# Altium project Kasli-SOC.PrjPcb (part 8 of 11)

## Sheet Kasli-SOC_PWR.SchDoc: Power
size 420 x 297 mm; CheckedBy: G.Kasprowicz; Author: F.Switakowski; CompanyName: WUT ISE; DrawnBy: F.Switakowski; Organization: WUT ISE; Address1: PW ISE; Address2: Nowowiejska 15/19 00-665 Warsaw; Address3: gkasprow@gmail.com; DocumentNumber: 15; Revision: 1; SheetNumber: 15; SheetTotal: 18; ModifiedBy: -; CheckedDate: -; Title2: Entry; DivGrp: WUT ISE; Designer: G.Kasprowicz; ModifiedDate: -; ProjectName: Sensor Box
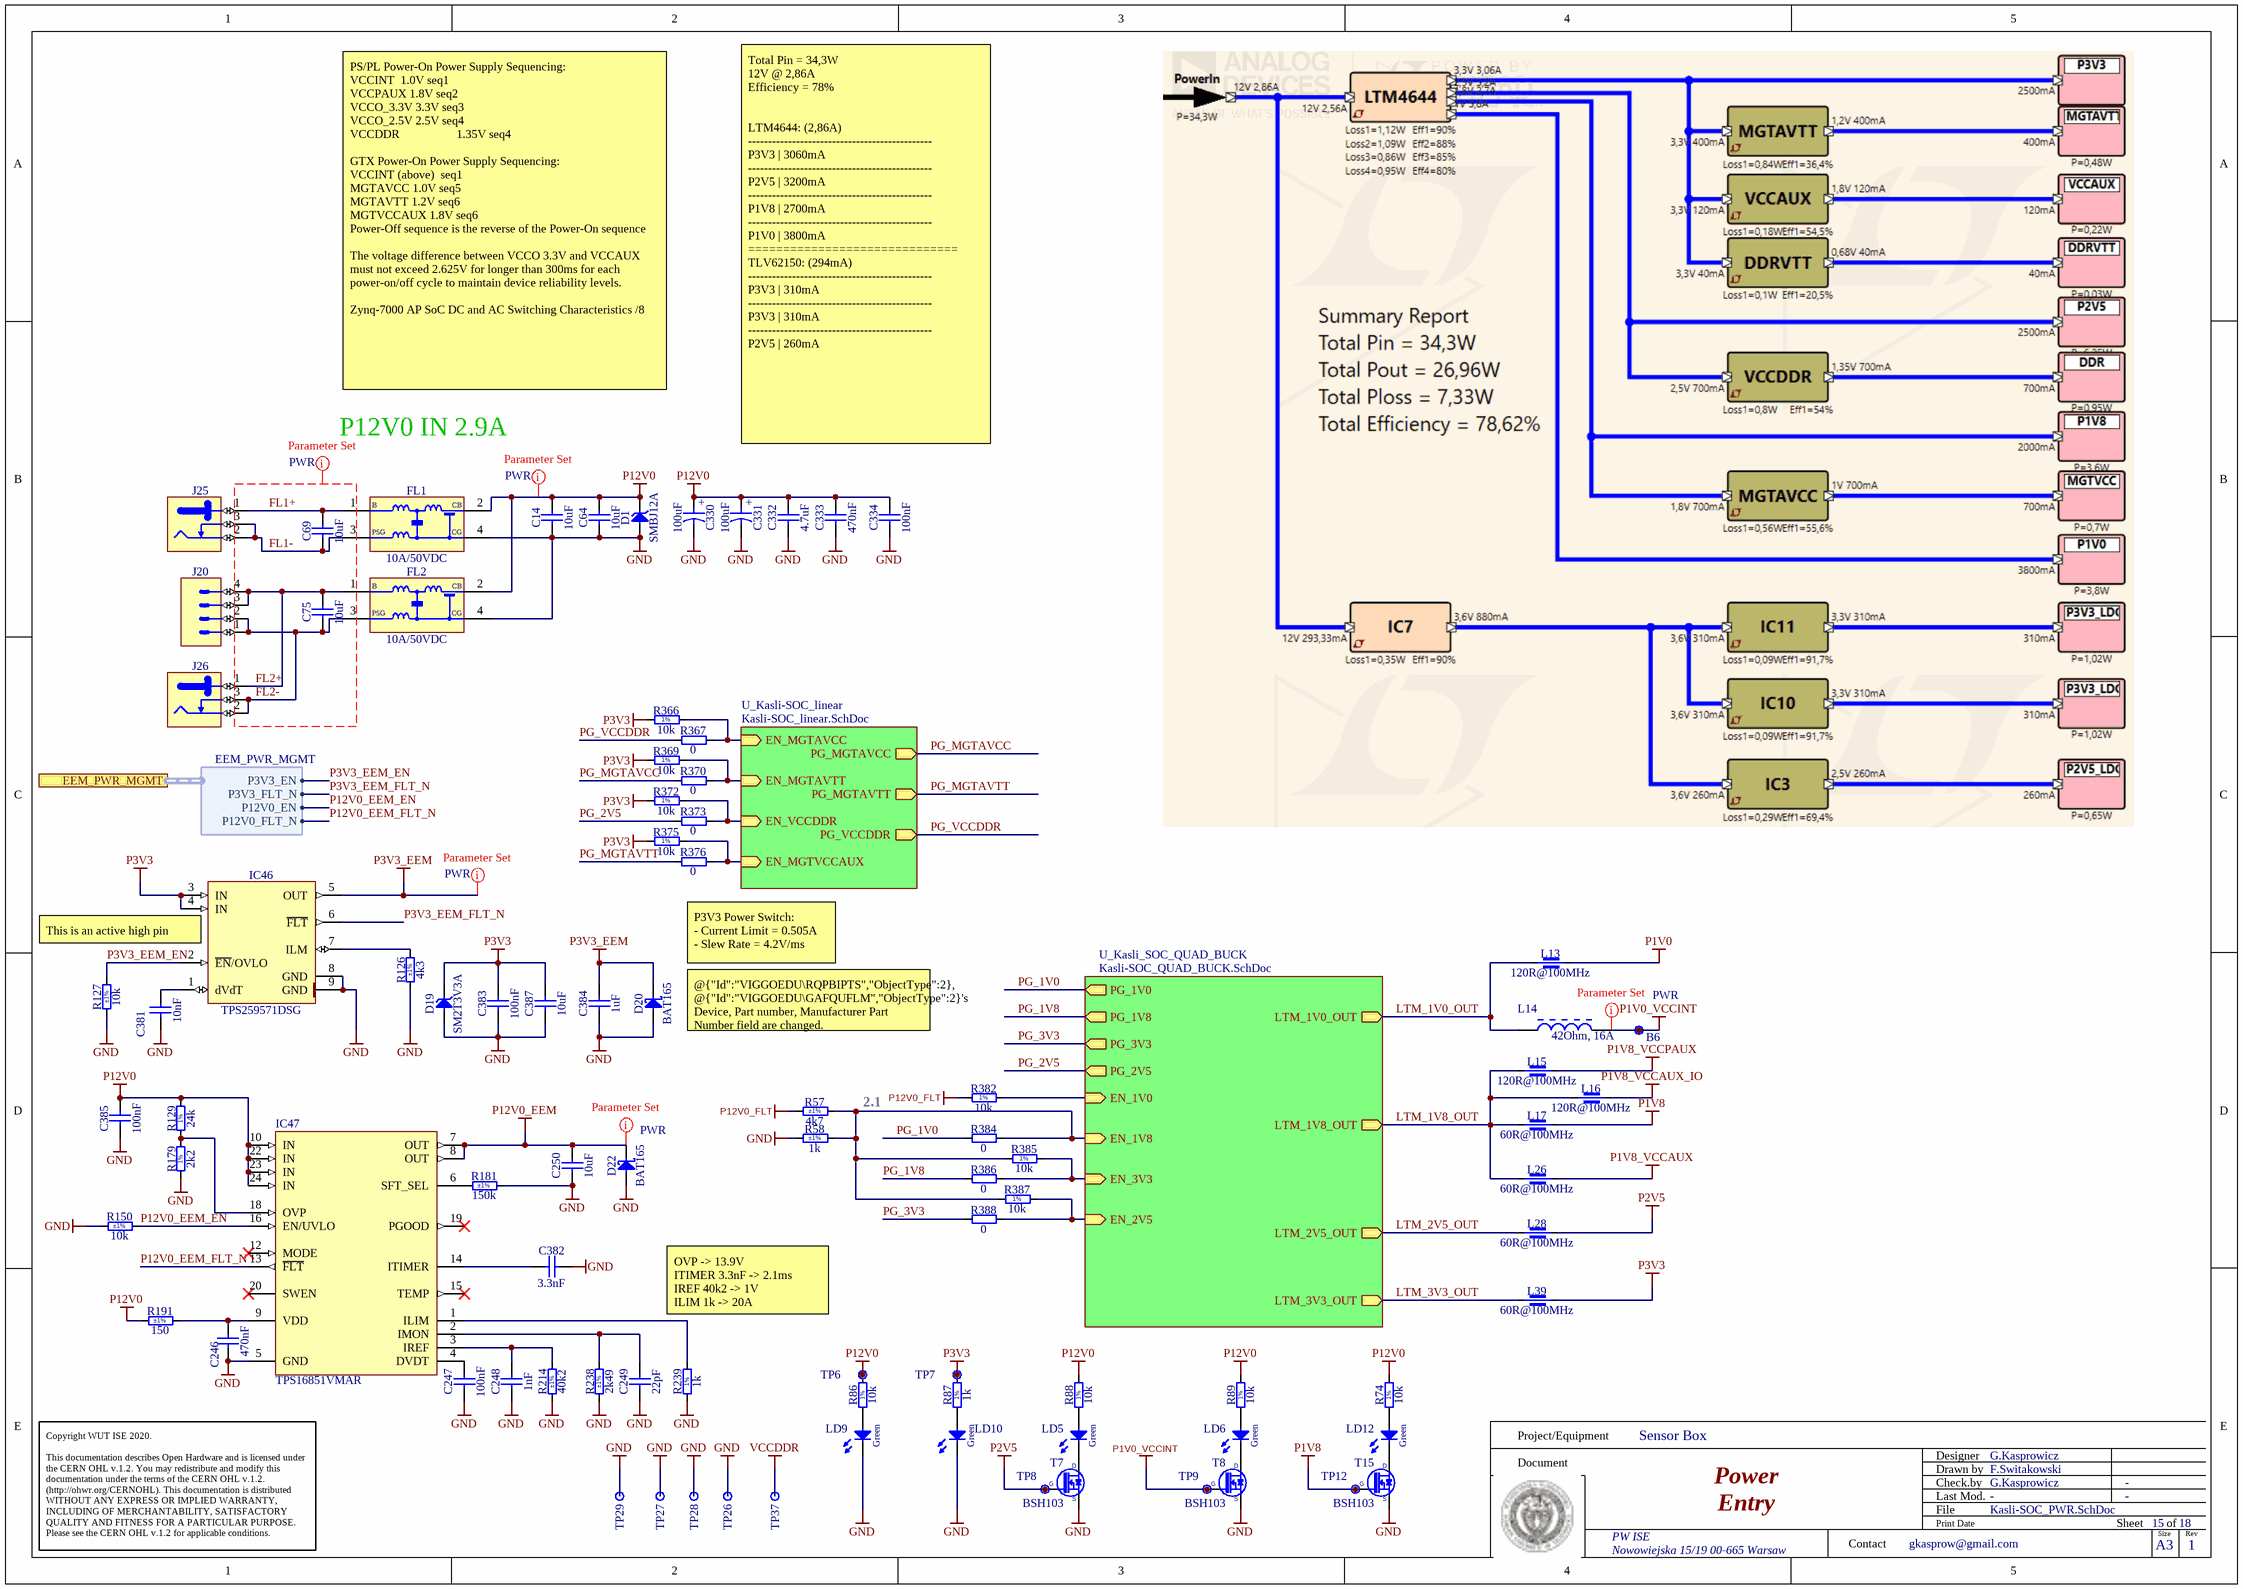
[diagram p13: Kasli-SOC_PWR.SchDoc]

### Parts
B6  SMD Pad  [C75]  (value not drawn)  (no BOM)
C14  10uF  [CAPC2012X95N]
C64  10uF  [CAPC2012X95N]
C69  10uF  [CAPC2012X95N]
C75  10uF  [CAPC2012X95N]
C246  470nF  [CAPC1005X55N]
C247  100nF  [CAPC1608X87N]
C248  1nF  [CAPC1005X55N]
C249  22pF  [CAPC1005X55N]
C250  10uF  [CAPC2012X95N]
C330  100uF  [CAPMP7343X310N]
C331  100uF  [CAPMP7343X310N]
C332  4.7uF  [CAPC1709X95N]
C333  470nF  [CAPC1005X55N]
C334  100nF  [CAPC1005X55N]
C381  10nF  [CAPC1005X55N]
C382  3.3nF  [CAPC1005X55N]
C383  100nF  [CAPC1608X87N]
C384  1uF  [CAPC1608X87N]
C385  100nF  [CAPC1608X87N]
C387  10uF  [CAPC2012X95N]
D1  SMBJ12A  [DIOM5336X265N]
D19  SM2T3V3A  [DO-216AA]
D20  BAT165  [SOD2512X110N]
D22  BAT165  [SOD2512X110N]
FL1  10A/50VDC  [FIL_MURATA_BNX02]
FL2  10A/50VDC  [FIL_MURATA_BNX02]
IC46  TPS259571DSG  [SON50P200X200X80-9N-R100X170]
IC47  TPS16851VMAR  [TPS16850VMAR]
J20  Mini-Fit Jr.™  [MOLEX_39-30-0040]  (value not drawn)
J25  Jack  [SWITCHCRAFT_712RA]  (value not drawn)
J26  Jack  [SWITCHCRAFT_712RA]  (value not drawn)
L13  120R@100MHz  [INDC1608X95N]
L14  42Ohm, 16A  [WE-PBF_4030_74279390]
L15  120R@100MHz  [INDC1608X95N]
L16  120R@100MHz  [INDC1608X95N]
L17  60R@100MHz  [INDC4516X180N]
L26  60R@100MHz  [INDC4516X180N]
L28  60R@100MHz  [INDC4516X180N]
L39  60R@100MHz  [INDC4516X180N]
LD5  Green  [LED_KINGBRIGHT_KPH-1608CGCK]
LD6  Green  [LED_KINGBRIGHT_KPH-1608CGCK]
LD9  Green  [LED_KINGBRIGHT_KPH-1608CGCK]
LD10  Green  [LED_KINGBRIGHT_KPH-1608CGCK]
LD12  Green  [LED_KINGBRIGHT_KPH-1608CGCK]
R57  4k7  Tolerance: ±1%  [RESC1005X40N]
R58  1k  Tolerance: ±1%  [RESC1005X40N]
R74  10k  [RESC1005X40N]
R86  10k  [RESC1005X40N]
R87  1k  [RESC1005X40N]
R88  10k  [RESC1005X40N]
R89  10k  [RESC1005X40N]
R126  4k3  Tolerance: ±1%  [RESC1005X40N]
R127  10k  Tolerance: ±1%  [RESC1005X40N]
R129  24k  [RESC1005X40N]
R150  10k  Tolerance: ±1%  [RESC1005X40N]
R179  2k2  [RESC1005X40N]
R181  150k  Tolerance: ±1%  [RESC1005X40N]
R191  150  Tolerance: ±1%  [RESC1005X40N]
R214  40k2  Tolerance: ±1%  [RESC1005X40N]
R238  2k49  Tolerance: ±1%  [RESC1608X55N]
R239  1k  [RESC1005X40N]
R366  10k  [RESC1005X40N]
R367  0  [RESC1005X40N]
R369  10k  [RESC1005X40N]
R370  0  [RESC1005X40N]
R372  10k  [RESC1005X40N]
R373  0  [RESC1005X40N]
R375  10k  [RESC1005X40N]
R376  0  [RESC1005X40N]
R382  10k  [RESC1005X40N]
R384  0  [RESC1005X40N]
R385  10k  [RESC1005X40N]
R386  0  [RESC1005X40N]
R387  10k  [RESC1005X40N]
R388  0  [RESC1005X40N]
T7  BSH103  [SOT95P230X110-3N]
T8  BSH103  [SOT95P230X110-3N]
T15  BSH103  [SOT95P230X110-3N]
TP6  P12V0  [TPS127]  (value not drawn)  (no BOM)
TP7  P3V3  [TPS127]  (value not drawn)  (no BOM)
TP8  P2V5  [TPS127]  (value not drawn)  (no BOM)
TP9  P1V0  [TPS127]  (value not drawn)  (no BOM)
TP12  P1V8  [TPS127]  (value not drawn)  (no BOM)
TP26  Test Point  [TPS127]  (value not drawn)  (no BOM)
TP27  Test Point  [TPS127]  (value not drawn)  (no BOM)
TP28  Test Point  [TPS127]  (value not drawn)  (no BOM)
TP29  Test Point  [VERO_20-313145]  (value not drawn)  (no BOM)
TP37  Test Point  [TPS127]  (value not drawn)  (no BOM)

### Sub-sheets
U_Kasli-SOC_linear = Kasli-SOC_linear.SchDoc: EN_MGTAVCC (in), EN_MGTAVTT (in), EN_VCCDDR (in), PG_MGTAVCC (out), PG_MGTAVTT (out), PG_VCCDDR (out), EN_MGTVCCAUX (in)
U_Kasli_SOC_QUAD_BUCK = Kasli-SOC_QUAD_BUCK.SchDoc: LTM_1V8_OUT (out), LTM_2V5_OUT (out), LTM_3V3_OUT (out), EN_1V0 (in), EN_1V8 (in), EN_2V5 (in), EN_3V3 (in), LTM_1V0_OUT (out), PG_1V0 (out), PG_1V8 (out), PG_3V3 (out), PG_2V5 (out)

### Ports
EEM_PWR_MGMT (harness EEM_PWR_MGMT)

### Harnesses
EEM_PWR_MGMT: P3V3_EN, P12V0_EN, P3V3_FLT_N, P12V0_FLT_N

### Nets
GND: C14.1 C64.1 C246.1 C247.1 C248.1 C249.1 C250.1 C330.2 C331.2 C332.1 C333.1 C334.1 C381.1 C382.2 C383.1 C384.1 C385.1 C387.1 D1.2(A) D19.2(A) D20.2(A) D22.2(A) FL1.4(CG) FL2.4(CG) IC46.8(GND) IC46.9(GND) IC47.5(GND) LD9.1(C) LD10.1(C) R58.1 R126.1 R127.1 R150.1 R179.1 R181.2 R214.1 R238.1 R239.1 T7.2(S) T8.2(S) T15.2(S) TP26.1 TP27.1 TP28.1 TP29.1
P1V0: L13.1
P1V0_VCCINT: B6.1 L14.2 T8.1(G) TP9.1
P1V8: L17.2 T15.1(G) TP12.1
P1V8_VCCAUX: L26.2
P1V8_VCCAUX_IO: L16.1
P1V8_VCCPAUX: L15.1
P2V5: L28.2 T7.1(G) TP8.1
P3V3: C383.2 C387.2 D19.1(C) IC46.3(IN) IC46.4(IN) L39.2 R87.2 R366.1 R369.1 R372.1 R375.1 TP7.1
P3V3_EEM: C384.2 D20.1(C) IC46.5(OUT)
P12V0: C14.2 C64.2 C330.1 C331.1 C332.2 C333.2 C334.2 C385.2 D1.1(C) FL1.2(CB) FL2.2(CB) IC47.10(IN) IC47.22(IN) IC47.23(IN) IC47.24(IN) R74.2 R86.2 R88.2 R89.2 R129.2 R191.1 TP6.1
P12V0_EEM: C250.2 D22.1(C) IC47.7(OUT) IC47.8(OUT)
P12V0_FLT: R57.1 R382.1
VCCDDR: TP37.1
EN_1V0: R382.2 ; sheet U_Kasli_SOC_QUAD_BUCK/EN_1V0
EN_1V8: R57.2 R58.2 R384.2 R385.1 R387.1 ; sheet U_Kasli_SOC_QUAD_BUCK/EN_1V8
EN_2V5: R387.2 R388.2 ; sheet U_Kasli_SOC_QUAD_BUCK/EN_2V5
EN_3V3: R385.2 R386.2 ; sheet U_Kasli_SOC_QUAD_BUCK/EN_3V3
EN_MGTAVCC: R366.2 R367.2 ; sheet U_Kasli-SOC_linear/EN_MGTAVCC
EN_MGTAVTT: R369.2 R370.2 ; sheet U_Kasli-SOC_linear/EN_MGTAVTT
EN_MGTVCCAUX: R375.2 R376.2 ; sheet U_Kasli-SOC_linear/EN_MGTVCCAUX
EN_VCCDDR: R372.2 R373.2 ; sheet U_Kasli-SOC_linear/EN_VCCDDR
FL1+: C69.2 FL1.1(B) J25.1
FL1-: C69.1 FL1.3(PSG) J25.2 J25.3
FL2+: C75.2 FL2.1(B) J20.3 J20.4 J26.1
FL2-: C75.1 FL2.3(PSG) J20.1 J20.2 J26.2 J26.3
LTM_1V0_OUT: L13.2 L14.1 ; sheet U_Kasli_SOC_QUAD_BUCK/LTM_1V0_OUT
LTM_1V8_OUT: L15.2 L16.2 L17.1 L26.1 ; sheet U_Kasli_SOC_QUAD_BUCK/LTM_1V8_OUT
LTM_2V5_OUT: L28.1 ; sheet U_Kasli_SOC_QUAD_BUCK/LTM_2V5_OUT
LTM_3V3_OUT: L39.1 ; sheet U_Kasli_SOC_QUAD_BUCK/LTM_3V3_OUT
P12V0_EEM_EN: IC46.2(~{EN}/OVLO) IC47.16(EN/UVLO) R127.2 R150.2 ; port EEM_PWR_MGMT.P3V3_EN, port EEM_PWR_MGMT.P12V0_EN  [also labelled P3V3_EEM_EN]  [project net EEM_PWR_EN]
P12V0_EEM_FLT_N: IC46.6(~{FLT}) IC47.13(~{FLT}) ; port EEM_PWR_MGMT.P3V3_FLT_N, port EEM_PWR_MGMT.P12V0_FLT_N  [also labelled P3V3_EEM_FLT_N]  [project net EEM_FLT_N]
PG_1V0: R384.1 ; sheet U_Kasli_SOC_QUAD_BUCK/PG_1V0
PG_1V8: R386.1 ; sheet U_Kasli_SOC_QUAD_BUCK/PG_1V8
PG_2V5: R373.1 ; sheet U_Kasli_SOC_QUAD_BUCK/PG_2V5
PG_3V3: R388.1 ; sheet U_Kasli_SOC_QUAD_BUCK/PG_3V3
PG_MGTAVCC: R370.1 ; sheet U_Kasli-SOC_linear/PG_MGTAVCC
PG_MGTAVTT: R376.1 ; sheet U_Kasli-SOC_linear/PG_MGTAVTT
PG_VCCDDR: R367.1 ; sheet U_Kasli-SOC_linear/PG_VCCDDR
NetC246_2: C246.2 IC47.9(VDD) R191.2
NetC247_2: C247.2 IC47.4(DVDT)
NetC248_2: C248.2 IC47.3(IREF) R214.2
NetC249_2: C249.2 IC47.2(IMON) R238.2
NetC381_2: C381.2 IC46.1(dVdT)
NetC382_1: C382.1 IC47.14(ITIMER)
NetIC46_7: IC46.7(ILM) R126.2
NetIC47_1: IC47.1(ILIM) R239.2
NetIC47_6: IC47.6(SFT_SEL) R181.1
NetIC47_18: IC47.18(OVP) R129.1 R179.2
NetLD5_1: LD5.1(C) T7.3(D)
NetLD5_2: LD5.2(A) R88.1
NetLD6_1: LD6.1(C) T8.3(D)
NetLD6_2: LD6.2(A) R89.1
NetLD9_2: LD9.2(A) R86.1
NetLD10_2: LD10.2(A) R87.1
NetLD12_1: LD12.1(C) T15.3(D)
NetLD12_2: LD12.2(A) R74.1

Not connected (* = marked no-connect by the designer): IC47 12(MODE)* 15(TEMP)* 19(PGOOD)* 20(SWEN)*

### Layout directives
net class PWR: FL1+, FL1-, FL2+, FL2-, P1V0_VCCINT, P3V3_EEM, P12V0, P12V0_EEM

### Notes on the sheet
- PS/PL Power-On Power Supply Sequencing:
  VCCINT		1.0V	seq1
  VCCPAUX	1.8V	seq2
  VCCO_3.3V	3.3V	seq3
  VCCO_2.5V	2.5V	seq4
  VCCDDR                  	1.35V	seq4
  GTX Power-On Power Supply Sequencing:
  VCCINT (above)		seq1
  MGTAVCC	1.0V	seq5
  MGTAVTT	1.2V	seq6
  MGTVCCAUX	1.8V	seq6
  Power-Off sequence is the reverse of the Power-On sequence
  The voltage difference between VCCO 3.3V and VCCAUX
  must not exceed 2.625V for longer than 300ms for each
  power-on/off cycle to maintain device reliability levels.
  Zynq-7000 AP SoC DC and AC Switching Characteristics /8
- P12V0 IN 2.9A
- Total Pin = 34,3W
  12V @ 2,86A
  Efficiency = 78%
  LTM4644: (2,86A)
  ----------------------------------------------
  P3V3	| 3060mA
  ----------------------------------------------
  P2V5	| 3200mA
  ----------------------------------------------
  P1V8	| 2700mA
  ----------------------------------------------
  P1V0	| 3800mA
  ==============================
  TLV62150: (294mA)
  ----------------------------------------------
  P3V3	| 310mA
  ----------------------------------------------
  P3V3	| 310mA
  ----------------------------------------------
  P2V5	| 260mA
- (near IC46) This is an active high pin
- P3V3 Power Switch:
  - Current Limit = 0.505A
  - Slew Rate = 4.2V/ms
- (near D20) @{"Id":"VIGGOEDU\RQPBIPTS","ObjectType":2}, @{"Id":"VIGGOEDU\GAFQUFLM","ObjectType":2}'s Device, Part number, Manufacturer Part Number field are changed.
  This symbol needs updating.
- 2.1
- VCCPAUX i VCCAUX
- OVP -> 13.9V
  ITIMER 3.3nF -> 2.1ms
  IREF 40k2 -> 1V
  ILIM 1k -> 20A
- Project/Equipment
- Document
- Designer
- Drawn by
- Check.by
- Copyright WUT ISE 2020.
  This documentation describes Open Hardware and is licensed under the CERN OHL v.1.2. You may redistribute and modify this documentation under the terms of the CERN OHL v.1.2. (http://ohwr.org/CERNOHL). This documentation is distributed WITHOUT ANY EXPRESS OR IMPLIED WARRANTY, INCLUDING OF MERCHANTABILITY, SATISFACTORY QUALITY AND FITNESS FOR A PARTICULAR PURPOSE. Please see the CERN OHL v.1.2 for applicable conditions.
- Contact
- File
- Last Mod.
- Print Date
- Sheet
- Size
- A3
- of
- Rev
- (in symbol CTE7343-31_100UF_20V_10%) +
- (in symbol R0402_1k_1%_0.0625W_100PPM) 1%
- (in symbol R0402_2K2_1%_0.0625W_100PPM) 1%
- (in symbol R0402_10k_1%_0.0625W_100PPM) 1%
- (in symbol R0402_10K_1%_0.0625W_100PPM) 1%
- (in symbol R0402_24K_1%_0.0625W_100PPM) 1%

### Library data of the parts
B6 = SMD_PAD_D0.75MM: Through Hole Pad; Part Description: 0.75mm Diameter SMD Pad; Mounted: No; Part Number: SMD_PAD_D0.75MM; Component Type: Standard (No BOM); Pin Count: 1; Family: SMD Pad; Socket: No; SMD: No; Sense: No; Status: None; ComponentHeight: 0mm; HelpURL: Undefined; Author: CERN DEM BC; CreateDate: 04.06.2020; LatestRevisionDate: 04.06.2020; PackageDescription: 0.75mm Diameter SMD Pad
C14 C64 C69 C75 C250 C387 = CC0805_10UF_25V_10%_X5R: Non-polarised capacitor; Part Description: SMD Multilayer Chip Ceramic Capacitor; Manufacturer: GENERIC; Manufacturer1 Part Number: GRM219R61E106KA12D; Voltage: 25V; TC: X5R; Tolerance: ±10%; Part Number: CC0805_10UF_25V_10%_X5R; Component Kind: Standard; Component Type: Standard; Pin Count: 2; Value: 10uF; Status: Preferred; Manufacturer Part Number: CC0805_10UF_25V_10%_X5R; Case: 0805; Mounted: Yes; Socket: No; SMD: Yes; Sense: No; Manufacturer1 Example: MURATA; Manufacturer1 ComponentHeight: 0.95mm; HelpURL: \\cern.ch\dfs\Applications\Altium\Datasheets\CC0805_X5R_MURATA_GRM.pdf; Author: CERN DEM JLC; CreateDate: 25.10.2012; LatestRevisionDate: 06.09.2016
C246 C333 = CC0402_470NF_16V_10%_X5R: Non-polarised capacitor; Part Description: SMD Multilayer Chip Ceramic Capacitor; Manufacturer: GENERIC; Manufacturer1 Part Number: C1005X5R1C105KT; Voltage: 16V; TC: X5R; Tolerance: ±10%; Part Number: CC0402_470NF_16V_10%_X5R; Component Kind: Standard; Component Type: Standard; Pin Count: 2; Value: 470nF; Status: Preferred; Manufacturer Part Number: CC0402_470NF_16V_10%_X5R; Case: 0402; Mounted: Yes; Socket: No; SMD: Yes; Sense: No; Manufacturer1 Example: TDK; Manufacturer1 ComponentHeight: 0.55mm; HelpURL: \\cern.ch\dfs\Applications\Altium\Datasheets\CC0402_X5R_TDK_C.pdf; Author: CERN DEM JLC; CreateDate: 10/25/2012; LatestRevisionDate: 10/25/2012
C247 C383 C385 = CC0603_100NF_50V_10%_X7R: Non-polarised capacitor; Part Description: SMD Multilayer Chip Ceramic Capacitor; Manufacturer: GENERIC; Manufacturer1 Part Number: 223858615649; Voltage: 50V; TC: X7R; Tolerance: ±10%; Part Number: CC0603_100NF_50V_10%_X7R; Component Kind: Standard; Component Type: Standard; Pin Count: 2; Value: 100nF; Status: Preferred; Manufacturer Part Number: CC0603_100NF_50V_10%_X7R; Case: 0603; Mounted: Yes; Socket: No; SMD: Yes; Sense: No; Manufacturer1 Example: PHYCOMP; Manufacturer1 ComponentHeight: 0.87mm; HelpURL: \\cern.ch\dfs\Applications\Altium\Datasheets\CC0603_X7R_PHYCOMP.pdf; Author: CERN DEM JLC; CreateDate: 12/3/2007; LatestRevisionDate: 12/3/2007
C248 = CC0402_1NF_50V_10%_X7R: Non-polarised capacitor; Part Description: SMD Multilayer Chip Ceramic Capacitor; Manufacturer: GENERIC; Manufacturer1 Part Number: 223858715623; Voltage: 50V; TC: X7R; Tolerance: ±10%; Part Number: CC0402_1NF_50V_10%_X7R; Component Kind: Standard; Component Type: Standard; Pin Count: 2; Value: 1nF; Status: Not Recommended; Manufacturer Part Number: CC0402_1NF_50V_10%_X7R; Case: 0402; Mounted: Yes; Socket: No; SMD: Yes; Sense: No; Manufacturer1 Example: PHYCOMP; Manufacturer1 ComponentHeight: 0.55mm; HelpURL: \\cern.ch\dfs\Applications\Altium\Datasheets\CC0402_X7R_PHYCOMP.pdf; Author: CERN DEM JLC; CreateDate: 03/12/2007; LatestRevisionDate: 03/12/2007
C249 = CC0402_22PF_50V_5%_C0G: Non-polarised capacitor; Part Description: SMD Multilayer Chip Ceramic Capacitor; Manufacturer: GENERIC; Manufacturer1 Part Number: C0402C220J5GACTU; Voltage: 50V; TC: C0G/NP0; Tolerance: ±5%; Part Number: CC0402_22PF_50V_5%_C0G; Component Kind: Standard; Component Type: Standard; Pin Count: 2; Value: 22pF; Status: Preferred; Manufacturer Part Number: CC0402_22PF_50V_5%_C0G; Case: 0402; Mounted: Yes; Socket: No; SMD: Yes; Sense: No; Manufacturer1 Example: KEMET; Manufacturer1 ComponentHeight: 0.55mm; HelpURL: \\cern.ch\dfs\Applications\Altium\Datasheets\CC0805_C0G_KEMET_(Commercial Grade).pdf; Author: CERN DEM JLC; CreateDate: 03.12.2007; LatestRevisionDate: 03.12.2007
C330 C331 = CTE7343-31_100UF_20V_10%: Polarised capacitor; Part Description: Solid Tantalum Chip Capacitor; Manufacturer: GENERIC; Manufacturer1 Part Number: TAJD107K020R; Voltage: 20V; Tolerance: ±10%; Part Number: CTE7343-31_100UF_20V_10%; Component Kind: Standard; Component Type: Standard; Pin Count: 2; Value: 100uF; Status: Preferred; Manufacturer Part Number: CTE7343-31_100UF_20V_10%; Case: D; Mounted: Yes; Socket: No; SMD: Yes; Sense: No; Manufacturer1 Example: AVX; Manufacturer1 ComponentHeight: 3.1mm; HelpURL: \\cern.ch\dfs\Applications\Altium\Datasheets\CTE_AVX_TAJ.pdf; Author: CERN DEM JLC; CreateDate: 03.12.2007; LatestRevisionDate: 03.12.2007
C332 = CC0603_4.7UF_16V_10%_X5R: Non-polarised capacitor; Part Description: SMD Multilayer Chip Ceramic Capacitor; Manufacturer: GENERIC; Manufacturer1 Part Number: EMK107ABJ475KA-T; Voltage: 16V; TC: X5R; Tolerance: ±10%; Part Number: CC0603_4.7UF_16V_10%_X5R; Component Kind: Standard; Component Type: Standard; Pin Count: 2; Value: 4.7uF; Status: None; Manufacturer Part Number: CC0603_4.7UF_16V_10%_X5R; Case: 0603; Mounted: Yes; Socket: No; SMD: Yes; Sense: No; Manufacturer1 Example: TAIYO YUDEN; Manufacturer1 ComponentHeight: 0.95mm; HelpURL: \\cern.ch\dfs\Applications\Altium\Datasheets\CC0603_X7R_TAIYO-YUDEN_HIGH-VALUE.pdf; Author: CERN DEM JLC; CreateDate: 16/12/2013; LatestRevisionDate: 16/09/2014
C334 = CC0402_100NF_16V_10%_X7R: Non-polarised capacitor; Part Description: SMD Multilayer Chip Ceramic Capacitor; Manufacturer: GENERIC; Manufacturer1 Part Number: GRM155R71C104KA88D; Voltage: 16V; TC: X7R; Tolerance: ±10%; Part Number: CC0402_100NF_16V_10%_X7R; Component Kind: Standard; Component Type: Standard; Pin Count: 2; Value: 100nF; Status: Not Recommended; Manufacturer Part Number: CC0402_100NF_16V_10%_X7R; Case: 0402; Mounted: Yes; Socket: No; SMD: Yes; Sense: No; Manufacturer1 Example: MURATA; Manufacturer1 ComponentHeight: 0.55mm; HelpURL: \\cern.ch\dfs\Applications\Altium\Datasheets\CC0402_X7R_MURATA_GRM.pdf; Author: CERN DEM JLC; CreateDate: 05/12/2013; LatestRevisionDate: 03/12/2007
C381 = CC0402_10NF_16V_10%_X7R: Non-polarised capacitor; Part Description: SMD Multilayer Chip Ceramic Capacitor; Manufacturer: GENERIC; Manufacturer1 Part Number: 223878715636; Voltage: 16V; TC: X7R; Tolerance: ±10%; Part Number: CC0402_10NF_16V_10%_X7R; Component Kind: Standard; Component Type: Standard; Pin Count: 2; Value: 10nF; Status: Not Recommended; Manufacturer Part Number: CC0402_10NF_16V_10%_X7R; Case: 0402; Mounted: Yes; Socket: No; SMD: Yes; Sense: No; Manufacturer1 Example: PHYCOMP; Manufacturer1 ComponentHeight: 0.55mm; HelpURL: \\cern.ch\dfs\Applications\Altium\Datasheets\CC0402_X7R_PHYCOMP.pdf; Author: CERN DEM JLC; CreateDate: 03.12.2007; LatestRevisionDate: 03.12.2007
C382 = CC0402_3.3NF_50V_10%_X7R: Non-polarised capacitor; Part Description: SMD Multilayer Chip Ceramic Capacitor; Manufacturer: GENERIC; Manufacturer1 Part Number: 223858715629; Voltage: 50V; TC: X7R; Tolerance: ±10%; Part Number: CC0402_3.3NF_50V_10%_X7R; Component Kind: Standard; Component Type: Standard; Pin Count: 2; Value: 3.3nF; Status: Not Recommended; Manufacturer Part Number: CC0402_3.3NF_50V_10%_X7R; Case: 0402; Mounted: Yes; Socket: No; SMD: Yes; Sense: No; Manufacturer1 Example: PHYCOMP; Manufacturer1 ComponentHeight: 0.55mm; HelpURL: \\cern.ch\dfs\Applications\Altium\Datasheets\CC0402_X7R_PHYCOMP.pdf; Author: CERN DEM JLC; CreateDate: 12/3/2007; LatestRevisionDate: 12/3/2007
C384 = CC0603_1UF_16V_10%_X7R: Non-polarised capacitor; Part Description: SMD Multilayer Chip Ceramic Capacitor; Manufacturer: GENERIC; Manufacturer1 Part Number: 223878615663; Voltage: 16V; TC: X7R; Tolerance: ±10%; Part Number: CC0603_1UF_16V_10%_X7R; Component Kind: Standard; Component Type: Standard; Pin Count: 2; Value: 1uF; Status: None; Manufacturer Part Number: CC0603_1UF_16V_10%_X7R; Case: 0603; Mounted: Yes; Socket: No; SMD: Yes; Sense: No; Manufacturer1 Example: YAGEO PHYCOMP; Manufacturer1 ComponentHeight: 0.9mm; HelpURL: \\cern.ch\dfs\Applications\Altium\Datasheets\CC0603_X7R_PHYCOMP.pdf; Author: CERN DEM JLC; CreateDate: 12/3/2007; LatestRevisionDate: 4/17/2015
D1 = SMBJ12A: Zener Diode; Part Description: Uni-Directional Transient Voltage Suppressor Diode; Manufacturer: FAIRCHILD SEMICONDUCTOR; Voltage: 12V; Power: 600W; PressFit: No; Bonding: No; Part Number: SMBJ12A; Component Kind: Standard; Component Type: Standard; Device: SMBJ12A; PackageDescription: DO-214-AA/SMB Diode, Molded Body; 5.34mm L X 3.625mm W X 2.65mm H, IPC Medium Density; Manufacturer Part Number: SMBJ12A; Pin Count: 2; Case: DO-214AA; Mounted: Yes; Socket: No; SMD: Yes; Sense: No; ComponentHeight: 2.65mm; HelpURL: \\cern.ch\dfs\Applications\Altium\Datasheets\SMBJ.pdf; Author: CERN DEM JLC; CreateDate: 10.04.2013; LatestRevisionDate: 10.04.2013
D19 = SM2T3V3A: Transient Voltage Suppressor Diode (Uni-Directional); Part Description: Low voltage Unidirectional Transil™ Diode; Manufacturer: ST MICROELECTRONICS; Voltage: 3V3; Power: 200W; PressFit: No; Bonding: No; Part Number: SM2T3V3A; Component Kind: Standard; Component Type: Standard; Device: SM2T3V3A; PackageDescription: DO-216-AA/SMB Molded Diode, Body 1.9x1.9mm, IPC Medium Density; Manufacturer Part Number: SM2T3V3A; Pin Count: 2; Case: DO-216AA; Mounted: Yes; Socket: No; SMD: Yes; Sense: No; ComponentHeight: 1.15mm; HelpURL: \\cern.ch\dfs\Applications\Altium\Datasheets\SM2T3V3A.pdf; Author: CERN DEM BR; CreateDate: 6/27/2019; LatestRevisionDate: 6/27/2019
D20 D22 = BAT165: Schottky Diode; Part Description: Medium Power AF Schottky Diode; Manufacturer: INFINEON; Voltage: 40V; Power: 750mA; PressFit: No; Bonding: No; Part Number: BAT165; Component Kind: Standard; Component Type: Standard; Device: BAT165; PackageDescription: Small Outline Diode (SOD-323), 1.70mm W X 1.25mm L X 1.10mm H body,  IPC Medium Density; Manufacturer Part Number: BAT165; Pin Count: 2; Case: SOD323; Mounted: Yes; Socket: No; SMD: Yes; Sense: No; ComponentHeight: 1.1mm; HelpURL: \\cern.ch\dfs\Applications\Altium\Datasheets\BAT165.pdf; Author: CERN DEM JLC; CreateDate: 12.11.2014; LatestRevisionDate: 12.11.2014
FL1 FL2 = FIL_MURATA_BNX022-01L: Block Type EMIFIL (LC Combined); Part Description: Block Type EMIFIL (LC Combined) SMD Type, BNX02* Series; Manufacturer: MURATA; Resistance: 0.5R; Part Number: FIL_MURATA_BNX022-01L; Component Kind: Standard; Component Type: Standard; Pin Count: 2; Value: 10A/50VDC; Status: None; Manufacturer Part Number: BNX022-01L; Mounted: Yes; Socket: No; SMD: Yes; Sense: No; ComponentHeight: 3.3mm; HelpURL: \\cern.ch\dfs\Applications\Altium\Datasheets\FIL_MURATA_BNX022-01L.pdf; Author: CERN DEM JLC; CreateDate: 10.10.2012; LatestRevisionDate: 10.10.2012
IC46 = TPS259573DSGR: 2.7V to 18V, 4A, 34-mOhm eFuse With Fast Programmable Overvoltage Protection; Part Description: 2.7V to 18V, 4A, 34-mOhm eFuse with Fast Overvoltage Protection; Manufacturer: TEXAS INSTRUMENTS; PressFit: No; Bonding: No; Part Number: TPS259571DSG; Component Kind: Standard; Component Type: Standard; Device: TPS259571DSG; PackageDescription: SON, 0.50mm Pitch; 8 Pin, 2.00mm W X 2.00mm L X 0.80mm H body (w/Thermal Tab 1.00 X 1.70mm), IPC Medium Density; Manufacturer Part Number: TPS259571DSG; Pin Count: 9; Case: SON8; Mounted: Yes; Socket: No; SMD: Yes; Sense: No; ComponentHeight: 0.8mm; Author: CERN DEM JLC; HelpURL: \\cern.ch\dfs\Applications\Altium\Datasheets\TPS259573DSGR.pdf; CreateDate: 1/16/2019; LatestRevisionDate: 6/13/2022
IC47 = TPS16850VMAR: Hot Swap Voltage Controllers 9V to 80V, 3.5mohm, 20A stackable integrated hot swap (eFuse) with accurate and fast current monitor; Manufacturer_Name: Texas Instruments; Geometry.Height: 1.5mm; Mouser Part Number: TPS16851VMAR; Mouser Price/Stock: TPS16851VMAR; Manufacturer_Part_Number: TPS16851VMAR; Datasheet Link: https://www.ti.com/lit/ds/symlink/tps1685.pdf?ts=1756708313660&ref_url=https%253A%252F%252Fwww.ti.com%252Fproduct%252FTPS1685
J20 = MOLEX_39-30-0040: Connector 4 Male; Part Description: 4.20mm (.165") Pitch Mini-Fit Jr. Header, Dual Row, Right Angle with Snap-in Plastic Peg PCB Lock, 4 Circuits; Manufacturer: MOLEX; PressFit: No; Part Number: MOLEX_39-30-0040; Component Kind: Standard; Component Type: Standard; Pin Count: 4; Family: Mini-Fit Jr.™; Mounted: Yes; Socket: No; SMD: No; Sense: No; Status: None; Manufacturer Part Number: 39-30-0040; ComponentHeight: 11.4mm; HelpURL: \\cern.ch\dfs\Applications\Altium\Datasheets\MOLEX_39-30-0040.pdf; Author: CERN DEM JLC; CreateDate: 2018-10-02; LatestRevisionDate: 2018-10-02
J25 J26 = SWITCHCRAFT_712RA: 2.5 mm Center Pin, 5A, 48V, Right Angle, Through Hole, , DC Power Jack Connector; Part Description: 2.5 mm Center Pin, 5A, 48VDC, Right Angle, Through Hole, Locking Power Jack Connector (Threaded Bushings); Manufacturer Part Number: 712RA; PressFit: No; Part Number: SWITCHCRAFT_712RA; Component Kind: Standard; Component Type: Standard; Pin Count: 3; Family: Jack; Mounted: Yes; Socket: No; SMD: No; Sense: No; Status: None; Manufacturer: SWITCHCRAFT; ComponentHeight: 13.8mm; HelpURL: \\cern.ch\dfs\Applications\Altium\Datasheets\SWITCHCRAFT_712RA.pdf; Author: CERN DEM JLC; CreateDate: 2017-12-19; LatestRevisionDate: 2017-12-19
L13 L15 L16 = IND0603_MURATA_BLM18PG121SN1D: Manufacturer: MURATA; Part Description: SMD EMIFIL Chip Ferrite Bead; Power: 2A; Resistance: 0.05R; Manufacturer Part Number: BLM18PG121SN1D; Part Number: IND0603_MURATA_BLM18PG121SN1D; Value: 120R@100MHz; Component Kind: Standard; Component Type: Standard; Pin Count: 2; Status: None; Case: 0603; Mounted: Yes; Socket: No; SMD: Yes; Sense: No; ComponentHeight: 0.95mm; HelpURL: \\cern.ch\dfs\Applications\Altium\Datasheets\IND0603_MURATA_BLM18P.pdf; Author: CERN DEM BC; CreateDate: 27.07.2015; LatestRevisionDate: 25.10.2018
L14 = 74279390: WE-PBF Flat Wire High Current SMT Ferrite Bead, size 4030, 42Ohm, 16A; Manufacturer: Wurth Elektronik; DC Resistance max.: 0.6mOhm; Impedance @25MHz: 28Ohm; Type: Glued; ComponentLink1Description: Manufacturer; ComponentLink1URL: http://www.we-online.de; ComponentLink2Description: Datasheet; ComponentLink2URL: https://www.we-online.com/catalog/datasheet/74279390.pdf; Manufacturer Part Number: 74279390; Mounting Technology: SMT; Operating Temperature: -55 to +125degC; Packaging: Tape and Reel; Height: 2.55mm; Length: 4mm; Impedance @100MHz: 42Ohm; Published Date: April 2020; Rated Current: 16A; Size: 4030; Width: 3mm
L17 L26 L28 L39 = IND1806_MURATA_BLM41PG600SN1L: Manufacturer: MURATA; Part Description: SMD EMI Suppression Chip Ferrite Bead (BLM41P Series); Power: 6A; Resistance: 0.01R; Manufacturer Part Number: BLM41PG600SN1L; Part Number: IND1806_MURATA_BLM41PG600SN1L; Value: 60R@100MHz; Component Kind: Standard; Component Type: Standard; Pin Count: 2; Status: None; Case: 1806; Mounted: Yes; Socket: No; SMD: Yes; Sense: No; ComponentHeight: 1.8mm; HelpURL: \\cern.ch\dfs\Applications\Altium\Datasheets\IND1806_MURATA_BLM41P.pdf; Author: CERN DEM JLC; CreateDate: 02.12.2009; LatestRevisionDate: 02.12.2009
LD5 LD6 LD9 LD10 LD12 = LED_KINGBRIGHT_KPH-1608CGCK: LED Green 1C 2A; Part Description: SMD Green LED, Case 1.6mmX0.8mm(0603), 0.65mm Thickness; PressFit: No; Bonding: No; Manufacturer Part Number: KPH-1608CGCK; ComponentHeight: 0.65mm; HelpURL: \\cern.ch\dfs\Applications\Altium\Datasheets\LED_KINGBRIGHT_KPH-1608CGCK.pdf; Part Number: LED_KINGBRIGHT_KPH-1608CGCK; Component Kind: Standard; Component Type: Standard; Color: Green; PackageDescription: SMT Green LED, Case 0603, Body L 1.6 x W 0.8mm H 0.65mm; Manufacturer: KINGBRIGHT; Pin Count: 2; Mounted: Yes; Socket: No; SMD: Yes; Sense: No; Author: CERN DEM JLC; CreateDate: 03.07.2017; LatestRevisionDate: 03.07.2017
R57 = R0402_4K7_1%_0.0625W_100PPM: Resistor - 1%; Part Description: General Purpose Thick Film Chip Resistor; Manufacturer: GENERIC; Manufacturer1 Part Number: 232270674702L; TC: ±100ppm/°C; PressFit: No; Part Number: R0402_4K7_1%_0.0625W_100PPM; Component Kind: Standard; Component Type: Standard; Pin Count: 2; Value: 4k7; Status: Not Recommended; Power: 0.0625W; Manufacturer Part Number: R0402_4K7_1%_0.0625W_100PPM; Case: 0402; Mounted: Yes; Sense: No; Socket: No; SMD: Yes; Manufacturer1 Example: YAGEO PHYCOMP; Manufacturer1 ComponentHeight: 0.4mm; HelpURL: \\cern.ch\dfs\Applications\Altium\Datasheets\R0402_Phycomp_RC0402.pdf; Author: CERN DEM JLC; CreateDate: 03.12.2007; LatestRevisionDate: 17.10.2012
R58 = R0402_1K_1%_0.0625W_100PPM: Resistor - 1%; Part Description: General Purpose Thick Film Chip Resistor; Manufacturer: GENERIC; Manufacturer1 Part Number: 232270671002L; TC: ±100ppm/°C; PressFit: No; Part Number: R0402_1K_1%_0.0625W_100PPM; Component Kind: Standard; Component Type: Standard; Pin Count: 2; Value: 1k; Status: Not Recommended; Power: 0.0625W; Manufacturer Part Number: R0402_1K_1%_0.0625W_100PPM; Case: 0402; Mounted: Yes; Sense: No; Socket: No; SMD: Yes; Manufacturer1 Example: YAGEO PHYCOMP; Manufacturer1 ComponentHeight: 0.4mm; HelpURL: \\cern.ch\dfs\Applications\Altium\Datasheets\R0402_Phycomp_RC0402.pdf; Author: CERN DEM JLC; CreateDate: 03.12.2007; LatestRevisionDate: 17.10.2012
R74 R86 R88 R89 = R0402_10k_1%_0.0625W_100PPM: Resistor - 1%; Part Description: General Purpose Thick Film Chip Resistor; Manufacturer: GENERIC; Manufacturer1 Part Number: 232270671003L; TC: ±100ppm/°C; PressFit: No; Part Number: R0402_10K_1%_0.0625W_100PPM; Component Kind: Standard; Component Type: Standard; Pin Count: 2; Value: 10k; Status: Not Recommended; Power: 0.0625W; Tolerance: ±1%; Manufacturer Part Number: R0402_10K_1%_0.0625W_100PPM; Case: 0402; Mounted: Yes; Sense: No; Socket: No; SMD: Yes; Manufacturer1 Example: YAGEO PHYCOMP; Manufacturer1 ComponentHeight: 0.4mm; HelpURL: \\cern.ch\dfs\Applications\Altium\Datasheets\R0402_Phycomp_RC0402.pdf; Author: CERN DEM JLC; CreateDate: 03.12.2007; LatestRevisionDate: 17.10.2012
R87 R239 = R0402_1k_1%_0.0625W_100PPM: Resistor - 1%; Part Description: General Purpose Thick Film Chip Resistor; Manufacturer: GENERIC; Manufacturer1 Part Number: 232270671002L; TC: ±100ppm/°C; PressFit: No; Part Number: R0402_1K_1%_0.0625W_100PPM; Component Kind: Standard; Component Type: Standard; Pin Count: 2; Value: 1k; Status: Not Recommended; Power: 0.0625W; Tolerance: ±1%; Manufacturer Part Number: R0402_1K_1%_0.0625W_100PPM; Case: 0402; Mounted: Yes; Sense: No; Socket: No; SMD: Yes; Manufacturer1 Example: YAGEO PHYCOMP; Manufacturer1 ComponentHeight: 0.4mm; HelpURL: \\cern.ch\dfs\Applications\Altium\Datasheets\R0402_Phycomp_RC0402.pdf; Author: CERN DEM JLC; CreateDate: 03.12.2007; LatestRevisionDate: 17.10.2012
R126 = R0402_4K3_1%_0.0625W_100PPM: Resistor - 1%; Part Description: General Purpose Thick Film Chip Resistor; Manufacturer: GENERIC; Manufacturer1 Part Number: 232270674302L; TC: ±100ppm/°C; PressFit: No; Part Number: R0402_4K3_1%_0.0625W_100PPM; Component Kind: Standard; Component Type: Standard; Pin Count: 2; Value: 4k3; Status: Not Recommended; Power: 0.0625W; Manufacturer Part Number: R0402_4K3_1%_0.0625W_100PPM; Case: 0402; Mounted: Yes; Sense: No; Socket: No; SMD: Yes; Manufacturer1 Example: YAGEO PHYCOMP; Manufacturer1 ComponentHeight: 0.4mm; HelpURL: \\cern.ch\dfs\Applications\Altium\Datasheets\R0402_Phycomp_RC0402.pdf; Author: CERN DEM JLC; CreateDate: 12/3/2007; LatestRevisionDate: 10/17/2012
R127 R150 R366 R369 R372 R375 R382 R385 R387 = R0402_10K_1%_0.0625W_100PPM: Resistor - 1%; Part Description: General Purpose Thick Film Chip Resistor; Manufacturer: GENERIC; Manufacturer1 Part Number: 232270671003L; TC: ±100ppm/°C; PressFit: No; Part Number: R0402_10K_1%_0.0625W_100PPM; Component Kind: Standard; Component Type: Standard; Pin Count: 2; Value: 10k; Status: Not Recommended; Power: 0.0625W; Manufacturer Part Number: R0402_10K_1%_0.0625W_100PPM; Case: 0402; Mounted: Yes; Sense: No; Socket: No; SMD: Yes; Manufacturer1 Example: YAGEO PHYCOMP; Manufacturer1 ComponentHeight: 0.4mm; HelpURL: \\cern.ch\dfs\Applications\Altium\Datasheets\R0402_Phycomp_RC0402.pdf; Author: CERN DEM JLC
  R127 R150: CreateDate: 12/3/2007; LatestRevisionDate: 10/17/2012
  R366 R369 R372 R375 R382 R385 R387: Tolerance: ±1%; CreateDate: 03.12.2007; LatestRevisionDate: 17.10.2012
R129 = R0402_24K_1%_0.0625W_100PPM: Resistor - 1%; Part Description: General Purpose Thick Film Chip Resistor; Manufacturer: GENERIC; Manufacturer1 Part Number: 232270672403L; TC: ±100ppm/°C; PressFit: No; Part Number: R0402_24K_1%_0.0625W_100PPM; Component Kind: Standard; Component Type: Standard; Pin Count: 2; Value: 24k; Status: Not Recommended; Power: 0.0625W; Tolerance: ±1%; Manufacturer Part Number: R0402_24K_1%_0.0625W_100PPM; Case: 0402; Mounted: Yes; Sense: No; Socket: No; SMD: Yes; Manufacturer1 Example: YAGEO PHYCOMP; Manufacturer1 ComponentHeight: 0.4mm; HelpURL: \\cern.ch\dfs\Applications\Altium\Datasheets\R0402_Phycomp_RC0402.pdf; Author: CERN DEM JLC; CreateDate: 03.12.2007; LatestRevisionDate: 17.10.2012
R179 = R0402_2K2_1%_0.0625W_100PPM: Resistor - 1%; Part Description: General Purpose Thick Film Chip Resistor; Manufacturer: GENERIC; Manufacturer1 Part Number: 232270672202L; TC: ±100ppm/°C; PressFit: No; Part Number: R0402_2K2_1%_0.0625W_100PPM; Component Kind: Standard; Component Type: Standard; Pin Count: 2; Value: 2k2; Status: Not Recommended; Power: 0.0625W; Tolerance: ±1%; Manufacturer Part Number: R0402_2K2_1%_0.0625W_100PPM; Case: 0402; Mounted: Yes; Sense: No; Socket: No; SMD: Yes; Manufacturer1 Example: YAGEO PHYCOMP; Manufacturer1 ComponentHeight: 0.4mm; HelpURL: \\cern.ch\dfs\Applications\Altium\Datasheets\R0402_Phycomp_RC0402.pdf; Author: CERN DEM JLC; CreateDate: 03.12.2007; LatestRevisionDate: 17.10.2012; ClassName: Artix
R181 = R0402_150K_1%_0.0625W_100PPM: Resistor - 1%; Part Description: General Purpose Thick Film Chip Resistor; Manufacturer: GENERIC; Manufacturer1 Part Number: 232270671504L; TC: ±100ppm/°C; PressFit: No; Part Number: R0402_150K_1%_0.0625W_100PPM; Component Kind: Standard; Component Type: Standard; Pin Count: 2; Value: 150k; Status: Not Recommended; Power: 0.0625W; Manufacturer Part Number: R0402_150K_1%_0.0625W_100PPM; Case: 0402; Mounted: Yes; Sense: No; Socket: No; SMD: Yes; Manufacturer1 Example: YAGEO PHYCOMP; Manufacturer1 ComponentHeight: 0.4mm; HelpURL: \\cern.ch\dfs\Applications\Altium\Datasheets\R0402_Phycomp_RC0402.pdf; Author: CERN DEM JLC; CreateDate: 03.12.2007; LatestRevisionDate: 17.10.2012
R191 = R0402_150R_1%_0.0625W_100PPM: Resistor - 1%; Part Description: General Purpose Thick Film Chip Resistor; Manufacturer: GENERIC; Manufacturer1 Part Number: 232270671501L; TC: ±100ppm/°C; PressFit: No; Part Number: R0402_150R_1%_0.0625W_100PPM; Component Kind: Standard; Component Type: Standard; Pin Count: 2; Value: 150; Status: Not Recommended; Power: 0.0625W; Manufacturer Part Number: R0402_150R_1%_0.0625W_100PPM; Case: 0402; Mounted: Yes; Sense: No; Socket: No; SMD: Yes; Manufacturer1 Example: YAGEO PHYCOMP; Manufacturer1 ComponentHeight: 0.4mm; HelpURL: \\cern.ch\dfs\Applications\Altium\Datasheets\R0402_Phycomp_RC0402.pdf; Author: CERN DEM JLC; CreateDate: 03.12.2007; LatestRevisionDate: 17.10.2012
R214 = R0402_40K2_1%_0.0625W_100PPM: Resistor - 1%; Part Description: General Purpose Thick Film Chip Resistor; Manufacturer: GENERIC; Manufacturer1 Part Number: CRCW040240K2FK; TC: ±100ppm/°C; PressFit: No; Part Number: R0402_40K2_1%_0.0625W_100PPM; Component Kind: Standard; Component Type: Standard; Pin Count: 2; Value: 40k2; Status: None; Power: 0.0625W; Manufacturer Part Number: R0402_40K2_1%_0.0625W_100PPM; Case: 0402; Mounted: Yes; Sense: No; Socket: No; SMD: Yes; Manufacturer1 Example: VISHAY; Manufacturer1 ComponentHeight: 0.4mm; HelpURL: \\cern.ch\dfs\Applications\Altium\Datasheets\R0402_VISHAY_CRCW.pdf; Author: CERN DEM HF; CreateDate: 25.11.2024; LatestRevisionDate: 25.11.2024
R238 = R0603_2K49_1%_0.063W_50PPM: Resistor - 1%; Part Description: General Purpose Thick Film Chip Resistor; Manufacturer: GENERIC; Manufacturer1 Part Number: CPF0603F2K49C1; Power: 0.063W; TC: ±50ppm/°C; PressFit: No; Part Number: R0603_2K49_1%_0.063W_50PPM; Component Kind: Standard; Component Type: Standard; Pin Count: 2; Value: 2k49; Status: None; Manufacturer Part Number: R0603_2K49_1%_0.063W_50PPM; Case: 0603; Mounted: Yes; Sense: No; Socket: No; SMD: Yes; Manufacturer1 Example: TYCO NEOHM; Manufacturer1 ComponentHeight: 0.55mm; HelpURL: \\cern.ch\dfs\Applications\Altium\Datasheets\R0603_TYCO_CPF.pdf; Author: CERN DEM JLC; CreateDate: 20.05.2010; LatestRevisionDate: 20.05.2010
R367 R370 R373 R376 R384 R386 R388 = R0402_0R_JUMPER: Resistor; Part Description: 1A (0.05R Max DC Resistance) Zero Ohm Jumper; Manufacturer: GENERIC; Manufacturer1 Part Number: 232270591001L; PressFit: No; Part Number: R0402_0R_JUMPER; Component Kind: Standard; Component Type: Standard; Pin Count: 2; Value: 0; Status: Not Recommended; Manufacturer Part Number: R0402_0R_JUMPER; Case: 0402; Mounted: Yes; Sense: No; Socket: No; SMD: Yes; Manufacturer1 Example: YAGEO PHYCOMP; Manufacturer1 ComponentHeight: 0.4mm; HelpURL: \\cern.ch\dfs\Applications\Altium\Datasheets\R0402_Phycomp_RC0402.pdf; Author: CERN DEM JLC; CreateDate: 03.12.2007; LatestRevisionDate: 17.10.2012
T7 T8 T15 = BSH103: N-CHANNEL MOSFET WITH DIODE; Part Description: 30V 850mA N-Channel Enhancement Mode Field-Effect Transistor; Manufacturer: NEXPERIA; PressFit: No; Bonding: No; Part Number: BSH103; Component Kind: Standard; Component Type: Standard; Device: BSH103; PackageDescription: SOT23, 3 pin, Pitch 0.95mm - 1.3mm W X 2.9mm L X 1.1mm H, IPC Medium Density; Manufacturer Part Number: BSH103; Pin Count: 3; Case: SOT23-3; Mounted: Yes; Socket: No; SMD: Yes; Sense: No; ComponentHeight: 1.1mm; HelpURL: \\cern.ch\dfs\Applications\Altium\Datasheets\BSH103.pdf; Author: CERN DEM JLC; CreateDate: 16.03.2010; LatestRevisionDate: 20.06.2017
TP6-TP9 TP12 = SMD_PAD_1.27X1.27MM: Test Point; Part Description: 1.27mm x 1.27mm PCB Copper Area (SMD Test Point); Mounted: No; Part Number: SMD_PAD_1.27X1.27MM; Component Type: Standard (No BOM); Pin Count: 1; Family: Test Point; Socket: No; SMD: Yes; Sense: No; Status: None; ComponentHeight: 0mm; HelpURL: Undefined; Author: CERN DEM JLC; CreateDate: 12.01.2008; LatestRevisionDate: 12.01.2008; PackageDescription: 1.27mm x 1.27mm PCB Copper Area (SMD Test Point)
TP26-TP28 TP37 = SMD_PAD_1.27X1.27MM: Part Description: 1.27mm x 1.27mm PCB Copper Area (SMD Test Point); Mounted: No; Part Number: SMD_PAD_1.27X1.27MM; Component Type: Standard (No BOM); Pin Count: 1; Family: Test Point; Socket: No; SMD: Yes; Sense: No; Status: None; ComponentHeight: 0mm; HelpURL: Undefined; Author: CERN DEM JLC; CreateDate: 12.01.2008; LatestRevisionDate: 12.01.2008; PackageDescription: 1.27mm x 1.27mm PCB Copper Area (SMD Test Point)
TP29 = VERO_20-313145: Part Description: Black Bead PCB Terminal Test Pin for 2.4mm PCB Thickness (1.32mm Hole); Manufacturer: VERO TECHNOLOGIES; PressFit: No; Part Number: VERO_20-313145; Component Type: Standard; Pin Count: 1; Family: Test Point; Mounted: Yes; Socket: No; SMD: No; Sense: No; Status: None; Manufacturer Part Number: 20-313145; ComponentHeight: 5.3mm; HelpURL: \\cern.ch\dfs\Applications\Altium\Datasheets\VERO_20-313145.pdf; Author: CERN DEM JLC; CreateDate: 15.07.2013; LatestRevisionDate: 15.07.2013